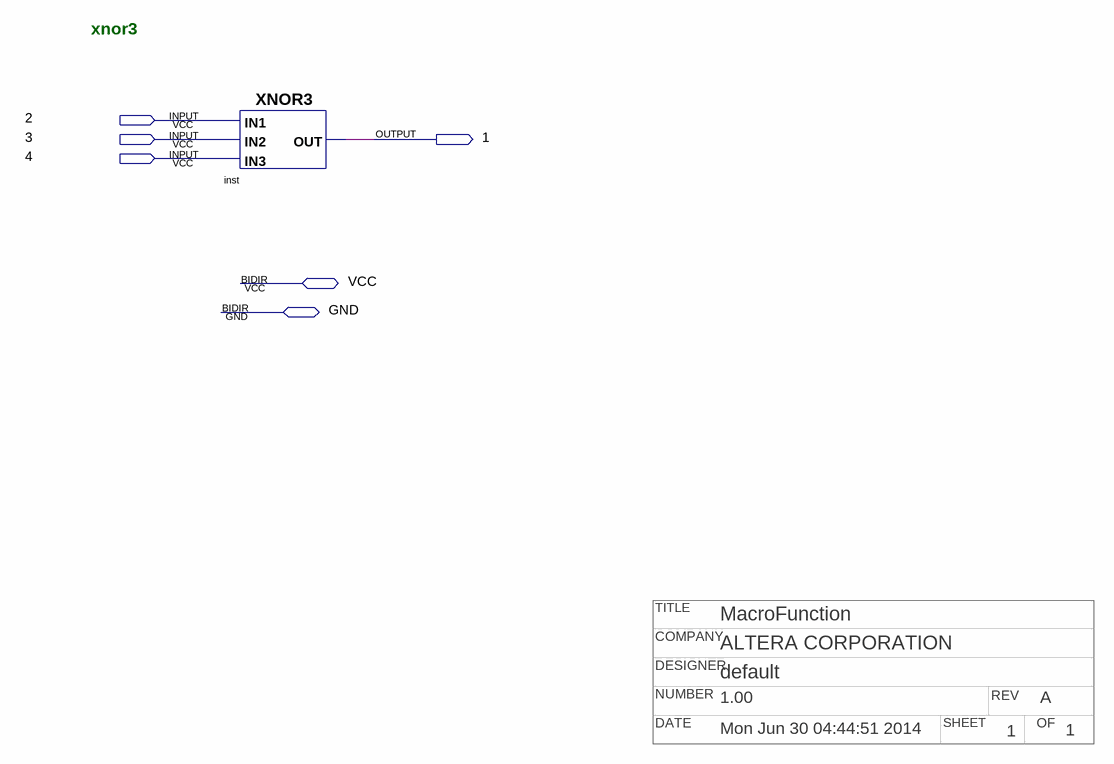
[diagram p0: schematic sheet]
// Quartus schematic npxnor3.bdf as structural Verilog: 1 symbols, 6 pins
// Title block: TITLE: MacroFunction; COMPANY: ALTERA CORPORATION; DESIGNER: default; NUMBER: 1.00; REV: A; DATE: Mon Jun 30 04:44:51 2014; SHEET: 1; OF: 1
module npxnor3 (
  input  \2 ,
  input  \3 ,
  input  \4 ,
  inout  VCC,
  inout  GND,
  output \1 
);

  XNOR3 inst (.IN3(\4 ), .IN2(\3 ), .IN1(\2 ), .OUT(\1 ));

  // Notes on the sheet:
  //   xnor3
endmodule
